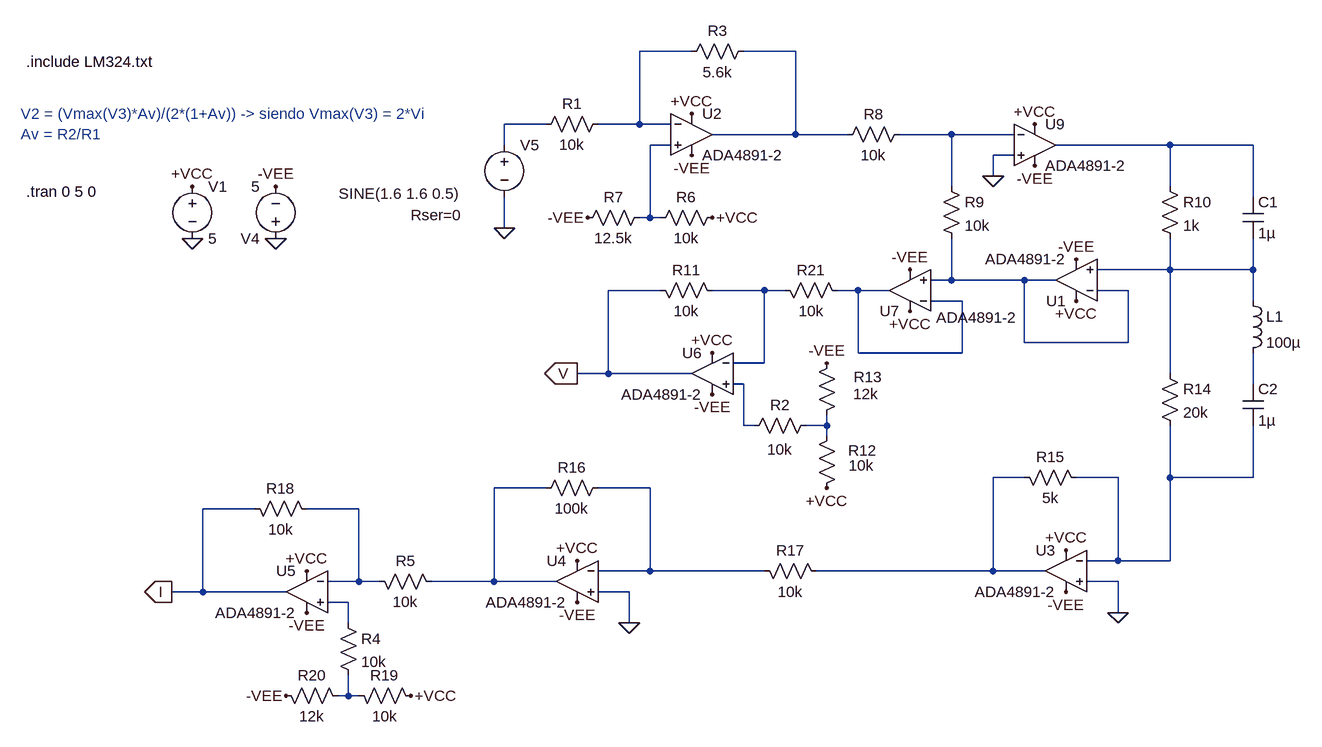
[diagram p0: schematic potenciostato_xy.asc]
potenciostato_xy.asc, the LTspice schematic file:
Version 4
SHEET 1 19688 680
WIRE -912 -384 -992 -384
WIRE -752 -384 -832 -384
WIRE -1136 -272 -1200 -272
WIRE -992 -272 -992 -384
WIRE -992 -272 -1056 -272
WIRE -944 -272 -992 -272
WIRE -752 -256 -752 -384
WIRE -752 -256 -880 -256
WIRE -672 -256 -752 -256
WIRE -512 -256 -592 -256
WIRE -416 -256 -512 -256
WIRE -1200 -240 -1200 -272
WIRE -944 -240 -976 -240
WIRE -176 -240 -352 -240
WIRE -48 -240 -176 -240
WIRE -416 -224 -448 -224
WIRE -448 -192 -448 -224
WIRE -512 -176 -512 -256
WIRE -176 -176 -176 -240
WIRE -48 -160 -48 -240
WIRE -976 -128 -976 -240
WIRE -976 -128 -992 -128
WIRE -960 -128 -976 -128
WIRE -1200 -112 -1200 -160
WIRE -176 -48 -176 -96
WIRE -176 -48 -288 -48
WIRE -48 -48 -48 -96
WIRE -48 -48 -176 -48
WIRE -512 -32 -512 -96
WIRE -512 -32 -544 -32
WIRE -400 -32 -512 -32
WIRE -352 -32 -400 -32
WIRE -960 -16 -1040 -16
WIRE -800 -16 -880 -16
WIRE -768 -16 -800 -16
WIRE -656 -16 -688 -16
WIRE -608 -16 -656 -16
WIRE -240 -16 -288 -16
WIRE -496 0 -544 0
WIRE -48 0 -48 -48
WIRE -400 64 -400 -32
WIRE -240 64 -240 -16
WIRE -240 64 -400 64
WIRE -656 80 -656 -16
WIRE -496 80 -496 0
WIRE -496 80 -656 80
WIRE -800 96 -800 -16
WIRE -800 96 -848 96
WIRE -1040 112 -1040 -16
WIRE -1040 112 -1088 112
WIRE -912 112 -1040 112
WIRE -176 112 -176 -48
WIRE -832 128 -848 128
WIRE -48 128 -48 80
WIRE -832 192 -832 128
WIRE -816 192 -832 192
WIRE -704 192 -704 176
WIRE -704 192 -736 192
WIRE -704 208 -704 192
WIRE -400 272 -448 272
WIRE -256 272 -320 272
WIRE -176 272 -176 192
WIRE -48 272 -48 192
WIRE -48 272 -176 272
WIRE -1136 288 -1216 288
WIRE -976 288 -1056 288
WIRE -1584 320 -1664 320
WIRE -1424 320 -1504 320
WIRE -256 400 -256 272
WIRE -256 400 -304 400
WIRE -176 400 -176 272
WIRE -176 400 -256 400
WIRE -976 416 -976 288
WIRE -976 416 -1056 416
WIRE -800 416 -976 416
WIRE -448 416 -448 272
WIRE -448 416 -720 416
WIRE -368 416 -448 416
WIRE -1424 432 -1424 320
WIRE -1424 432 -1472 432
WIRE -1392 432 -1424 432
WIRE -1216 432 -1216 288
WIRE -1216 432 -1312 432
WIRE -1120 432 -1216 432
WIRE -256 432 -304 432
WIRE -1664 448 -1664 320
WIRE -1664 448 -1712 448
WIRE -1536 448 -1664 448
WIRE -1008 448 -1056 448
WIRE -1440 464 -1472 464
WIRE -256 480 -256 432
WIRE -1440 496 -1440 464
WIRE -1008 496 -1008 448
WIRE -1440 608 -1440 576
WIRE -1440 608 -1456 608
WIRE -1424 608 -1440 608
FLAG -912 -288 +VCC
FLAG -1680 -96 0
FLAG -1680 -176 +VCC
FLAG -1552 -96 0
FLAG -1552 -176 -VEE
FLAG -912 -224 -VEE
FLAG -880 -128 +VCC
FLAG -1072 -128 -VEE
FLAG -1200 -112 0
FLAG -384 -272 +VCC
FLAG -384 -208 -VEE
FLAG -448 -192 0
FLAG -320 0 +VCC
FLAG -320 -64 -VEE
FLAG -880 80 +VCC
FLAG -880 144 -VEE
FLAG -704 288 +VCC
FLAG -704 96 -VEE
FLAG -1088 112 V
IOPIN -1088 112 Out
FLAG -336 384 +VCC
FLAG -336 448 -VEE
FLAG -256 480 0
FLAG -1088 400 +VCC
FLAG -1088 464 -VEE
FLAG -1008 496 0
FLAG -1504 416 +VCC
FLAG -1504 480 -VEE
FLAG -1344 608 +VCC
FLAG -1536 608 -VEE
FLAG -1712 448 I
IOPIN -1712 448 Out
FLAG -576 16 +VCC
FLAG -576 -48 -VEE
SYMBOL voltage -1680 -192 R0
WINDOW 123 0 0 Left 2
WINDOW 39 0 0 Left 2
SYMATTR InstName V1
SYMATTR Value 5
SYMBOL res -816 -400 R90
WINDOW 0 0 56 VBottom 2
WINDOW 3 32 56 VTop 2
SYMATTR InstName R3
SYMATTR Value 5.6k
SYMBOL voltage -1552 -80 R180
WINDOW 123 0 0 Left 2
WINDOW 39 0 0 Left 2
SYMATTR InstName V4
SYMATTR Value 5
SYMBOL res -976 -112 R270
WINDOW 0 32 56 VTop 2
WINDOW 3 0 56 VBottom 2
SYMATTR InstName R6
SYMATTR Value 10k
SYMBOL res -1088 -112 R270
WINDOW 0 32 56 VTop 2
WINDOW 3 0 56 VBottom 2
SYMATTR InstName R7
SYMATTR Value 12.5k
SYMBOL voltage -1200 -256 R0
WINDOW 123 0 0 Left 2
WINDOW 39 -144 124 Left 2
WINDOW 3 -255 91 Left 2
SYMATTR SpiceLine Rser=0
SYMATTR Value SINE(1.6 1.6 0.5)
SYMATTR InstName V5
SYMBOL res -576 -272 R90
WINDOW 0 0 56 VBottom 2
WINDOW 3 32 56 VTop 2
SYMATTR InstName R8
SYMATTR Value 10k
SYMBOL res -528 -192 R0
SYMATTR InstName R9
SYMATTR Value 10k
SYMBOL res -192 -192 R0
SYMATTR InstName R10
SYMATTR Value 1k
SYMBOL res -976 -32 M90
WINDOW 0 0 56 VBottom 2
WINDOW 3 32 56 VTop 2
SYMATTR InstName R11
SYMATTR Value 10k
SYMBOL res -688 192 M0
WINDOW 0 -61 38 Left 2
WINDOW 3 -57 61 Left 2
SYMATTR InstName R12
SYMATTR Value 10k
SYMBOL res -688 80 M0
WINDOW 0 -70 37 Left 2
WINDOW 3 -64 63 Left 2
SYMATTR InstName R13
SYMATTR Value 12k
SYMBOL res -192 96 R0
SYMATTR InstName R14
SYMATTR Value 20k
SYMBOL res -304 288 M270
WINDOW 0 32 56 VTop 2
WINDOW 3 0 56 VBottom 2
SYMATTR InstName R15
SYMATTR Value 5k
SYMBOL res -1152 304 R270
WINDOW 0 32 56 VTop 2
WINDOW 3 0 56 VBottom 2
SYMATTR InstName R16
SYMATTR Value 100k
SYMBOL res -704 432 M270
WINDOW 0 32 56 VTop 2
WINDOW 3 0 56 VBottom 2
SYMATTR InstName R17
SYMATTR Value 10k
SYMBOL res -1600 304 M90
WINDOW 0 0 56 VBottom 2
WINDOW 3 32 56 VTop 2
SYMATTR InstName R18
SYMATTR Value 10k
SYMBOL res -1440 592 M90
WINDOW 0 0 56 VBottom 2
WINDOW 3 32 56 VTop 2
SYMATTR InstName R19
SYMATTR Value 10k
SYMBOL res -1552 592 M90
WINDOW 0 0 56 VBottom 2
WINDOW 3 32 56 VTop 2
SYMATTR InstName R20
SYMATTR Value 12k
SYMBOL res -1040 -288 R90
WINDOW 0 0 56 VBottom 2
WINDOW 3 32 56 VTop 2
SYMATTR InstName R1
SYMATTR Value 10k
SYMBOL OpAmps\\ADA4891-2 -912 -320 R0
SYMATTR InstName U2
SYMBOL OpAmps\\ADA4891-2 -384 -304 R0
SYMATTR InstName U9
SYMBOL OpAmps\\ADA4891-2 -320 32 R180
SYMATTR InstName U1
SYMBOL OpAmps\\ADA4891-2 -336 352 M0
SYMATTR InstName U3
SYMBOL OpAmps\\ADA4891-2 -1088 368 M0
SYMATTR InstName U4
SYMBOL OpAmps\\ADA4891-2 -1504 384 M0
SYMATTR InstName U5
SYMBOL OpAmps\\ADA4891-2 -880 48 M0
SYMATTR InstName U6
SYMBOL res -1408 416 M90
WINDOW 0 0 56 VBottom 2
WINDOW 3 32 56 VTop 2
SYMATTR InstName R5
SYMATTR Value 10k
SYMBOL res -1456 480 R0
SYMATTR InstName R4
SYMATTR Value 10k
SYMBOL res -720 176 R90
WINDOW 0 0 56 VBottom 2
WINDOW 3 37 56 VTop 2
SYMATTR InstName R2
SYMATTR Value 10k
SYMBOL res -784 -32 M90
WINDOW 0 0 56 VBottom 2
WINDOW 3 32 56 VTop 2
SYMATTR InstName R21
SYMATTR Value 10k
SYMBOL OpAmps\\ADA4891-2 -576 48 R180
WINDOW 3 -165 22 Left 2
SYMATTR InstName U7
SYMBOL cap -64 -160 R0
SYMATTR InstName C1
SYMATTR Value 1µ
SYMBOL cap -64 128 R0
SYMATTR InstName C2
SYMATTR Value 1µ
SYMBOL ind -64 -16 R0
SYMATTR InstName L1
SYMATTR Value 100µ
TEXT -1936 -168 Left 2 !.tran 0 5 0
TEXT -1944 -288 Left 2 ;V2 = (Vmax(V3)*Av)/(2*(1+Av)) -> siendo Vmax(V3) = 2*Vi\nAv = R2/R1
TEXT -1936 -368 Left 2 !.include LM324.txt

The netlist it stands for:
* potenciostato_xy.asc
V1 +VCC 0 5
R3 N002 N001 5.6k
V4 0 -VEE 5
R6 N005 +VCC 10k
R7 -VEE N005 12.5k
V5 N003 0 SINE(1.6 1.6 0.5) Rser=0
R8 N004 N002 10k
R9 N004 N008 10k
R10 N006 N007 1k
R11 V N009 10k
R12 N013 +VCC 10k
R13 -VEE N013 12k
R14 N007 N015 20k
R15 N015 N014 5k
R16 N016 N017 100k
R17 N014 N017 10k
R18 I N018 10k
R19 N020 +VCC 10k
R20 -VEE N020 12k
R1 N001 N003 10k
XU2 N005 N001 +VCC -VEE N002 ADA4891-2  ; pins In+ In- V+ V- OUT
XU9 0 N004 +VCC -VEE N006 ADA4891-2  ; pins In+ In- V+ V- OUT
XU1 N007 N008 +VCC -VEE N008 ADA4891-2  ; pins In+ In- V+ V- OUT
XU3 0 N015 +VCC -VEE N014 ADA4891-2  ; pins In+ In- V+ V- OUT
XU4 0 N017 +VCC -VEE N016 ADA4891-2  ; pins In+ In- V+ V- OUT
XU5 N019 N018 +VCC -VEE I ADA4891-2  ; pins In+ In- V+ V- OUT
XU6 N011 N009 +VCC -VEE V ADA4891-2  ; pins In+ In- V+ V- OUT
R5 N018 N016 10k
R4 N019 N020 10k
R2 N013 N011 10k
R21 N009 N010 10k
XU7 N008 N010 +VCC -VEE N010 ADA4891-2  ; pins In+ In- V+ V- OUT
C1 N006 N007 1µ
C2 N012 N015 1µ
L1 N007 N012 100µ
.tran 0 5 0
* V2 = (Vmax(V3)*Av)/(2*(1+Av)) -> siendo Vmax(V3) = 2*Vi
* Av = R2/R1
.include LM324.txt
.backanno
.end